# EAGLE design Uebergangsloesung (EAGLE 7.4.0)
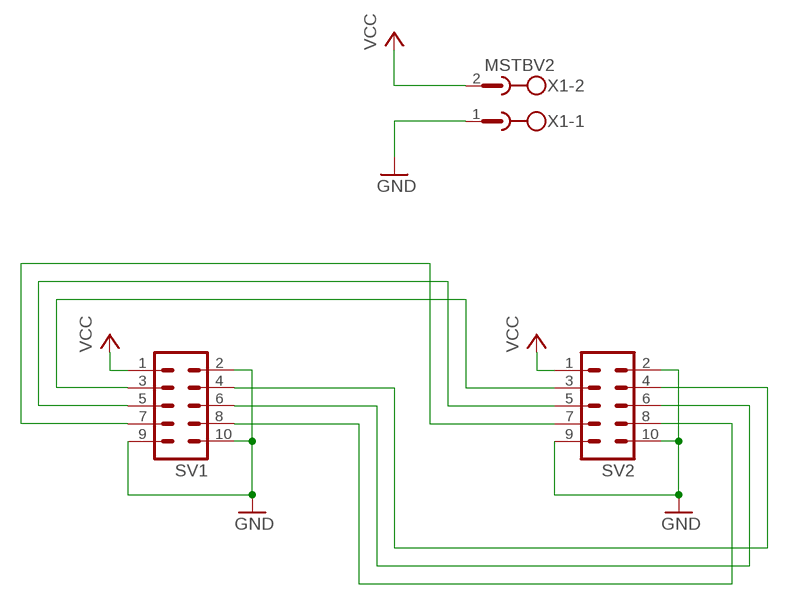
[diagram p0: schematic, sheet 1]

## Parts
SV1  ML10  [ML10]
SV2  ML10  [ML10]
X1  MSTBV2  [MSTBV2]

## Nets
GND: SV1.2 SV1.9 SV1.10 SV2.2 SV2.9 SV2.10 X1.1
N$1: SV1.3 SV2.3
N$2: SV1.5 SV2.5
N$3: SV1.7 SV2.7
N$4: SV1.4 SV2.4
N$5: SV1.6 SV2.6
N$6: SV1.8 SV2.8
VCC: SV1.1 SV2.1 X1.2

## Library data of the parts
SV1 SV2 = con-harting-ml:ML10: HARTING; OC_FARNELL: unknown; OC_NEWARK: unknown
X1 = con-phoenix-508:MSTBV2: PHOENIX; MPN: MSTBV 2,5/2-GF-5.08; OC_FARNELL: 1792792; OC_NEWARK: 69R9845

## Board
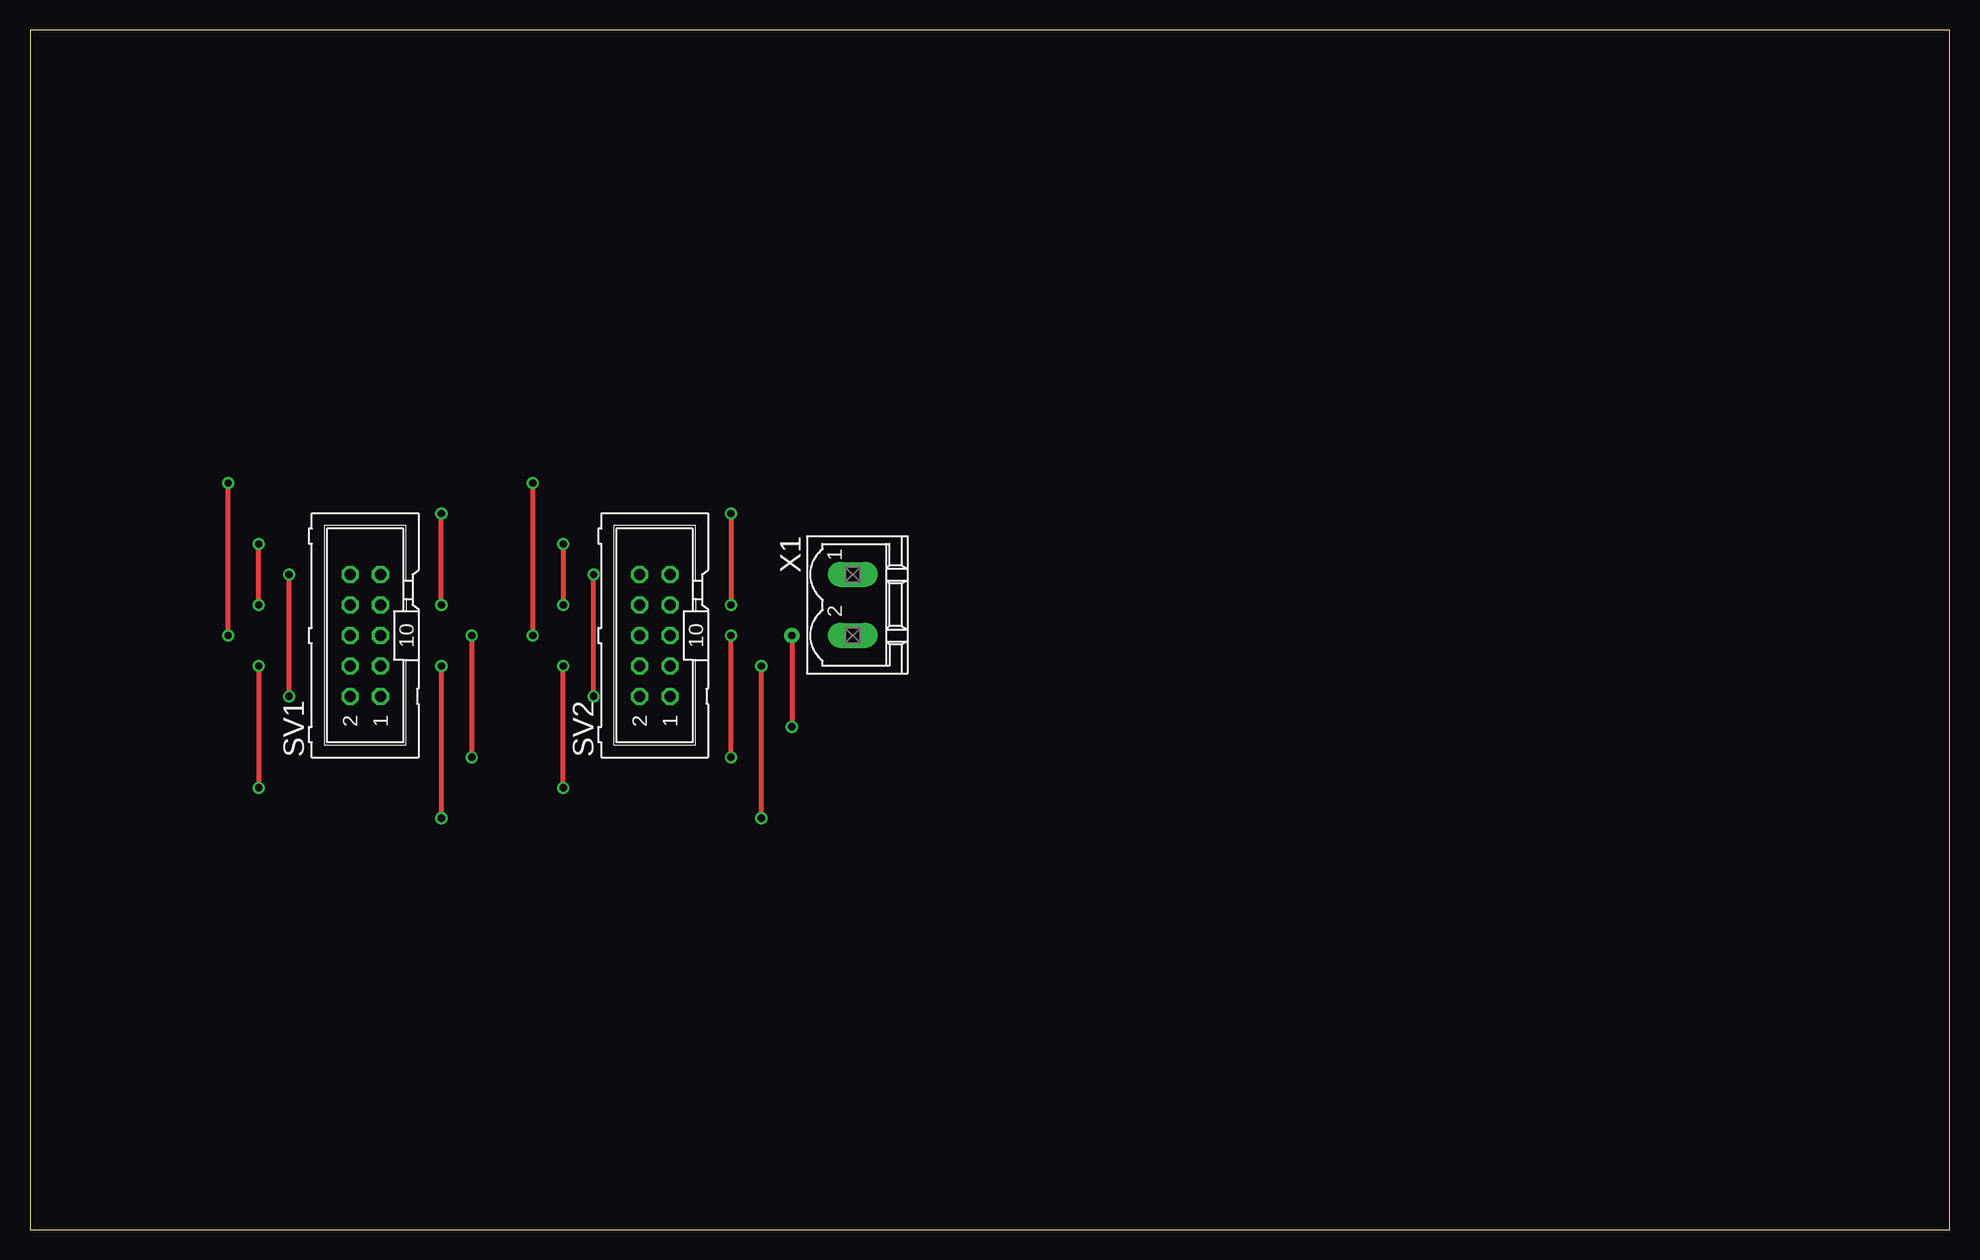
[diagram p1: board, top side]
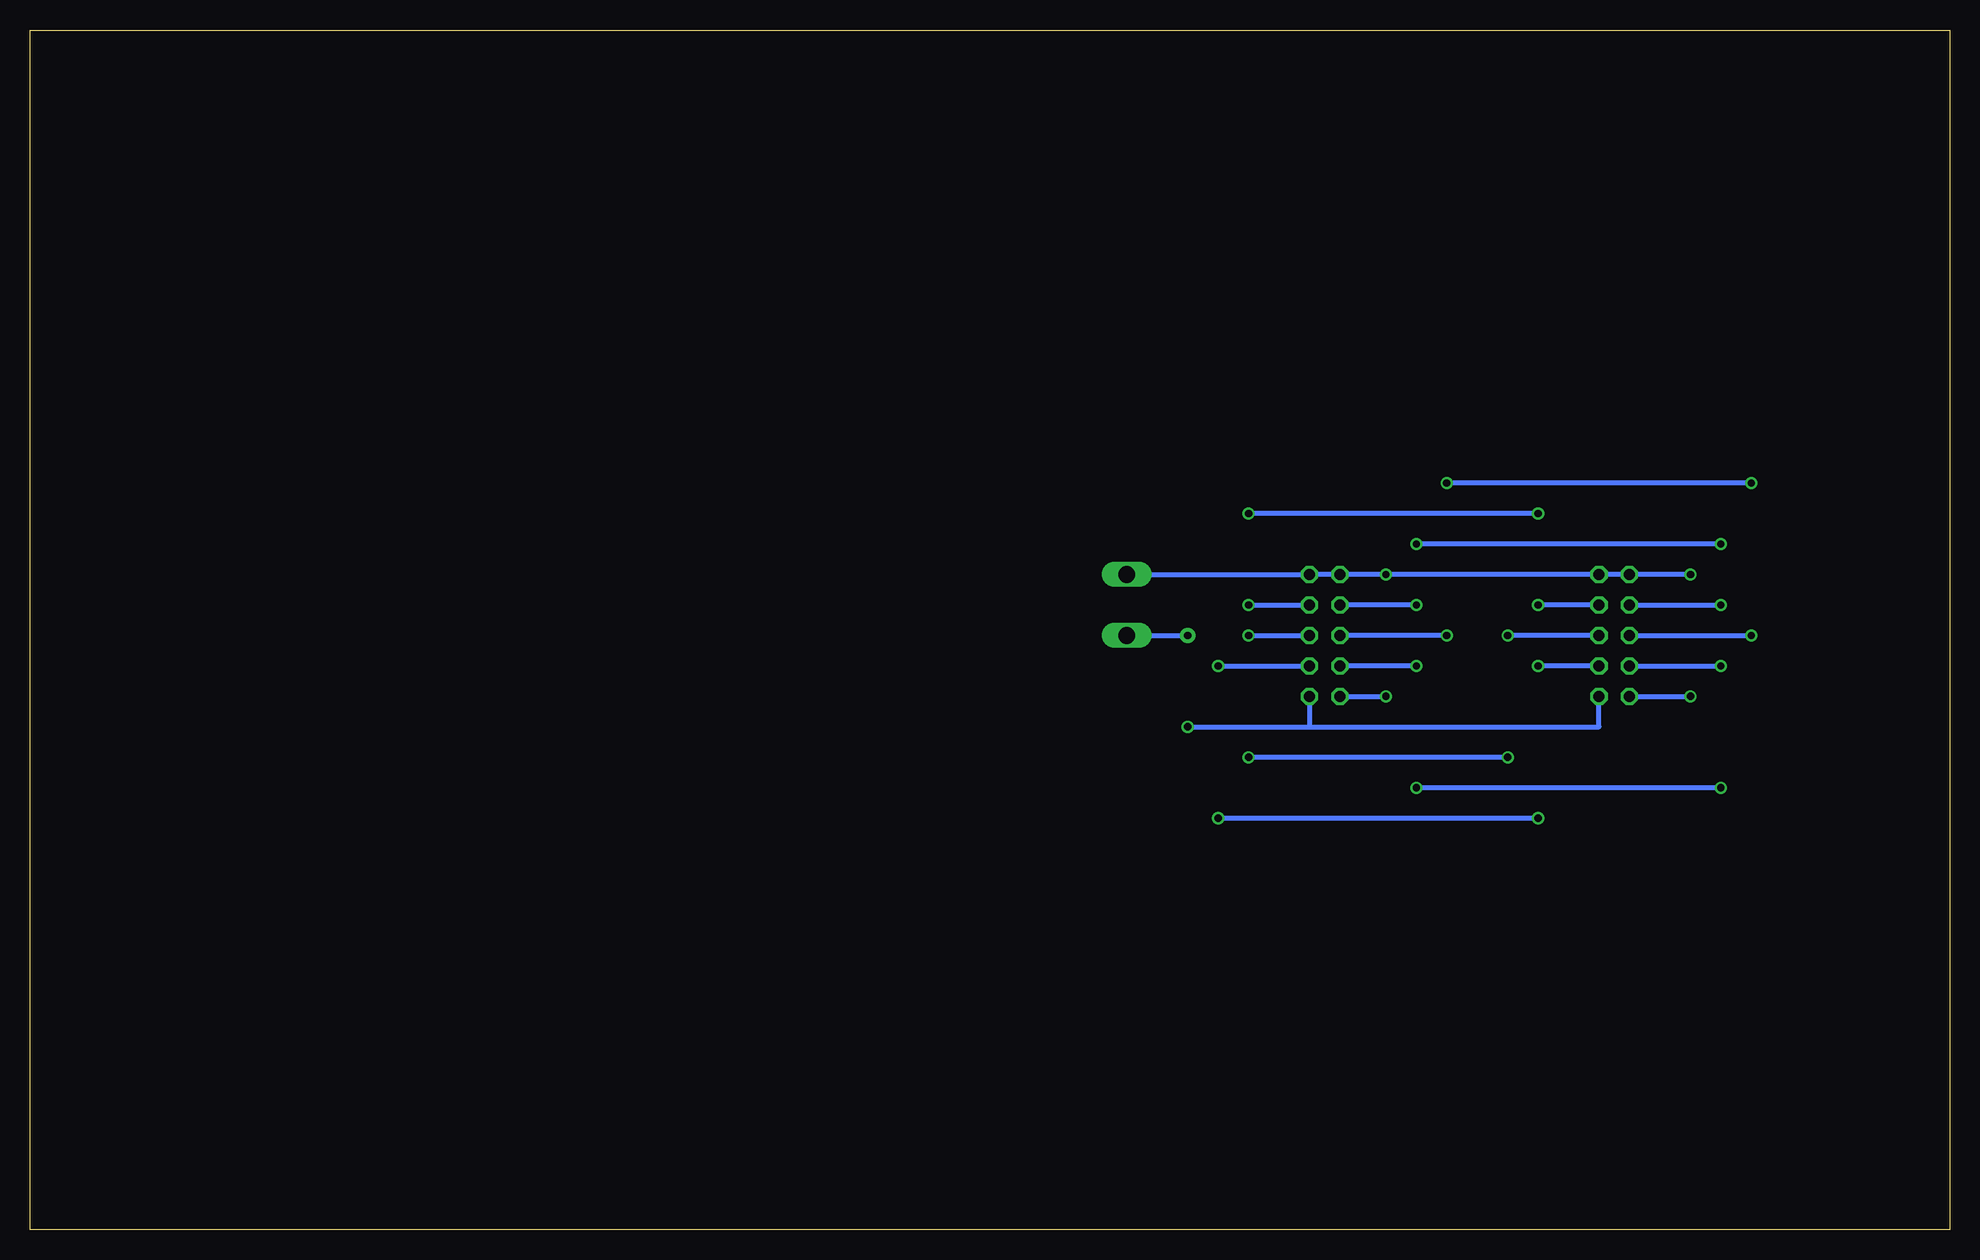
[diagram p2: board, bottom side, seen from below]

Size 160 x 100 mm. Coordinates in mm from the lower left corner, seen from the top.
Outline: 0,0 160,0 160,100 0,100 0,0
Copper layers (1*16): Top 0.035mm / dielectric 1.5mm / Bottom 0.035mm
Design rules "default": minimum track width 10mil, minimum drill 24mil, track to track 8mil, track to pad 8mil, pad to pad 8mil, via to via 8mil, smd to smd 8mil, copper to edge 40mil, drill to drill 8mil, minimum pad ring 10mil, minimum via ring 8mil, stop-mask expansion 4mil, vias tented up to drill 0mil, thermal gap 10mil

### Footprints (pad centres in the part's own frame; a part is rotated, then mirrored left to right if it is on the bottom)
ML10 = drill 0.914 octagon: 1 -5.08,-1.27; 2 -5.08,1.27; 3 -2.54,-1.27; 4 -2.54,1.27; 5 0,-1.27; 6 0,1.27; 7 2.54,-1.27; 8 2.54,1.27; 9 5.08,-1.27; 10 5.08,1.27
MSTBV2 = drill 1.397 long: 1 -2.54,0; 2 2.54,0

### Placement (x,y rotation side)
SV1  27.94,49.53 90 top
SV2  52.07,49.53 90 top
X1  68.58,52.07 270 top

### Tracks (layer width: path | path; a pad name or v marks a point on that pad's centre or on a via)
GND  (via drill 0.6)
  Top 0.406: v46.99,44.45 v46.99,54.61 | v21.59,44.45 v21.59,54.61
  Bottom 0.406: SV2.2 v46.99,44.45 | SV1.2 v21.59,44.45 | v21.59,54.61 SV1.10 SV1.9 v46.99,54.61 SV2.10 SV2.9 X1.1
N$1  (via drill 0.6)
  Top 0.406: v34.29,46.99 v34.29,34.29 | v60.96,34.29 v60.96,46.99
  Bottom 0.406: SV1.3 v34.29,46.99 | v34.29,34.29 v60.96,34.29 | v60.96,46.99 SV2.3
N$2  (via drill 0.6)
  Top 0.406: v36.83,49.53 v36.83,39.37 | v58.42,39.37 v58.42,49.53
  Bottom 0.406: SV1.5 v36.83,49.53 | v36.83,39.37 v58.42,39.37 | v58.42,49.53 SV2.5
N$3  (via drill 0.6)
  Top 0.406: v34.29,52.07 v34.29,59.69 | v58.42,59.69 v58.42,52.07
  Bottom 0.406: SV1.7 v34.29,52.07 | v34.29,59.69 v58.42,59.69 | v58.42,52.07 SV2.7
N$4  (via drill 0.6)
  Top 0.406: v19.05,46.99 v19.05,36.83 | v44.45,36.83 v44.45,46.99
  Bottom 0.406: SV1.4 v19.05,46.99 | v19.05,36.83 v44.45,36.83 | v44.45,46.99 SV2.4
N$5  (via drill 0.6)
  Top 0.406: v16.51,49.53 v16.51,62.23 | v41.91,62.23 v41.91,49.53
  Bottom 0.406: SV1.6 v16.51,49.53 | v16.51,62.23 v41.91,62.23 | v41.91,49.53 SV2.6
N$6  (via drill 0.6)
  Top 0.406: v19.05,52.07 v19.05,57.15 | v44.45,57.15 v44.45,52.07
  Bottom 0.406: SV1.8 v19.05,52.07 | v19.05,57.15 v44.45,57.15 | v44.45,52.07 SV2.8
VCC  (via drill 0.6, 0.6 pad 1.27)
  Top 0.406: v63.5,49.53 v63.5,41.91
  Bottom 0.406: v63.5,41.91 53.34,41.91 | SV2.1 53.34,41.91 | 53.34,41.91 29.21,41.91 SV1.1 | X1.2 v63.5,49.53